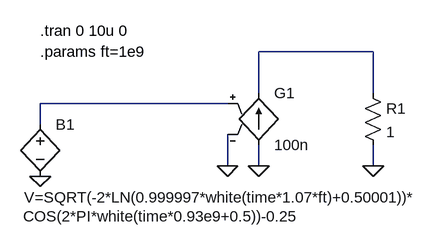
[diagram p0: schematic Flash_noise_current.asc]
Flash_noise_current.asc, the LTspice schematic file:
Version 4
SHEET 1 1060 680
WIRE 512 112 336 112
WIRE 336 176 336 112
WIRE 512 176 512 112
WIRE 288 192 0 192
WIRE 0 224 0 192
WIRE 288 288 288 240
WIRE 336 288 336 256
WIRE 512 288 512 256
FLAG 0 304 0
FLAG 336 288 0
FLAG 512 288 0
FLAG 288 288 0
SYMBOL bv 0 208 R0
WINDOW 123 -26 158 Left 0
WINDOW 3 -25 129 Left 0
SYMATTR Value2 COS(2*PI*white(time*0.93e9+0.5))-0.25
SYMATTR Value V=SQRT(-2*LN(0.999997*white(time*1.07*ft)+0.50001))*
SYMATTR InstName B1
SYMBOL g 336 160 R0
SYMATTR InstName G1
SYMATTR Value 100n
SYMBOL res 496 160 R0
SYMATTR InstName R1
SYMATTR Value 1
TEXT 0 80 Left 0 !.tran 0 10u 0
TEXT 0 112 Left 0 !.params ft=1e9

The netlist it stands for:
* Flash_noise_current.asc
B1 N002 0 V=SQRT(-2*LN(0.999997*white(time*1.07*ft)+0.50001))* COS(2*PI*white(time*0.93e9+0.5))-0.25
G1 0 N001 N002 0 100n
R1 N001 0 1
.tran 0 10u 0
.params ft=1e9
.backanno
.end